# EAGLE design iceWerx Carrier before Lab 4 (EAGLE 9.6.2)
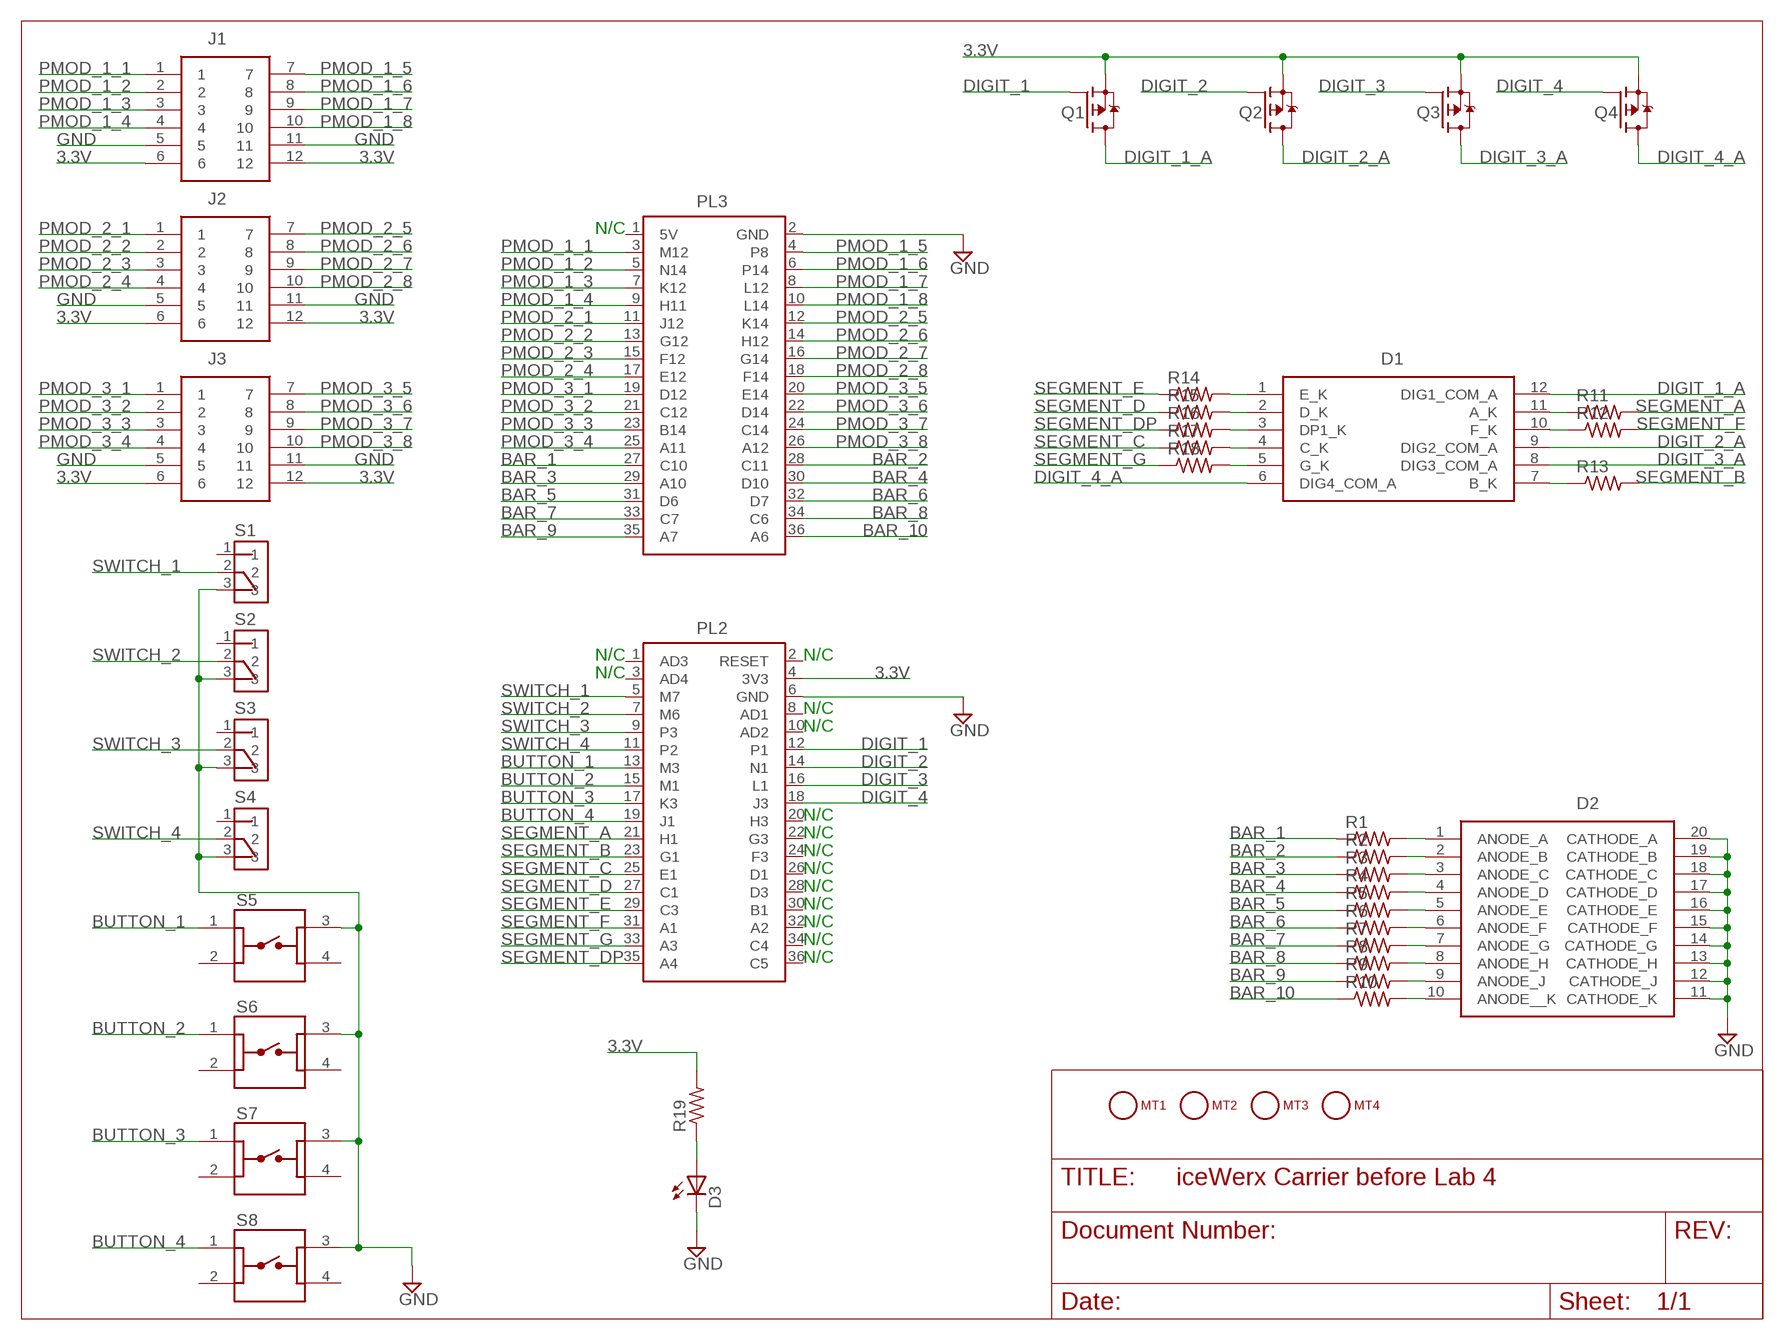
[diagram p0: schematic, sheet 1]

## Parts
D1  LDQ-M282RI  [LDQM282RI]
D2  LTA-1000G  [DIPS762W50P254L2527H825Q20N]
D3  LED5MM  [LED5MM]
J1  PMOD-SOCKET-FOR-HOST-BOARD  [PMOD-SOCKET-FOR-HOST-BOARD]
J2  PMOD-SOCKET-FOR-HOST-BOARD  [PMOD-SOCKET-FOR-HOST-BOARD]
J3  PMOD-SOCKET-FOR-HOST-BOARD  [PMOD-SOCKET-FOR-HOST-BOARD]
MT1  MOUNTING_HOLE-125_250_ROUND  [MT_125_250]
MT2  MOUNTING_HOLE-125_250_ROUND  [MT_125_250]
MT3  MOUNTING_HOLE-125_250_ROUND  [MT_125_250]
MT4  MOUNTING_HOLE-125_250_ROUND  [MT_125_250]
PL2  ICEWERX-PL2  [TE_4-1734506-1]
PL3  ICEWERX-PL3  [TE_4-1734506-1]
Q1  NX2301P  [SOT95P230X110-3N]
Q2  NX2301P  [SOT95P230X110-3N]
Q3  NX2301P  [SOT95P230X110-3N]
Q4  NX2301P  [SOT95P230X110-3N]
R1  R-US_0204/5  [0204/5]
R2  R-US_0204/5  [0204/5]
R3  R-US_0204/5  [0204/5]
R4  R-US_0204/5  [0204/5]
R5  R-US_0204/5  [0204/5]
R6  R-US_0204/5  [0204/5]
R7  R-US_0204/5  [0204/5]
R8  R-US_0204/5  [0204/5]
R9  R-US_0204/5  [0204/5]
R10  R-US_0204/5  [0204/5]
R11  R-US_0204/5  [0204/5]
R12  R-US_0204/5  [0204/5]
R13  R-US_0204/5  [0204/5]
R14  R-US_0204/5  [0204/5]
R15  R-US_0204/5  [0204/5]
R16  R-US_0204/5  [0204/5]
R17  R-US_0204/5  [0204/5]
R18  R-US_0204/5  [0204/5]
R19  R-US_0204/5  [0204/5]
S1  OS102011MS2QN1  [SW_OS102011MS2QN1]
S2  OS102011MS2QN1  [SW_OS102011MS2QN1]
S3  OS102011MS2QN1  [SW_OS102011MS2QN1]
S4  OS102011MS2QN1  [SW_OS102011MS2QN1]
S5  1825910-7  [SW_1825910-7]
S6  1825910-7  [SW_1825910-7]
S7  1825910-7  [SW_1825910-7]
S8  1825910-7  [SW_1825910-7]

## Nets
3.3V: J1.6 J1.12 J2.6 J2.12 J3.6 J3.12 PL2.4(3V3) Q1.2(S) Q2.2(S) Q3.2(S) Q4.2(S) R19.2
BAR_1: PL3.27(C10) R1.1
BAR_2: PL3.28(C11) R2.1
BAR_3: PL3.29(A10) R3.1
BAR_4: PL3.30(D10) R4.1
BAR_5: PL3.31(D6) R5.1
BAR_6: PL3.32(D7) R6.1
BAR_7: PL3.33(C7) R7.1
BAR_8: PL3.34(C6) R8.1
BAR_9: PL3.35(A7) R9.1
BAR_10: PL3.36(A6) R10.1
BUTTON_1: PL2.13(M3) S5.1
BUTTON_2: PL2.15(M1) S6.1
BUTTON_3: PL2.17(K3) S7.1
BUTTON_4: PL2.19(J1) S8.1
DIGIT_1: PL2.12(P1) Q1.1(G)
DIGIT_1_A: D1.12(DIG1_COM_A) Q1.3(D)
DIGIT_2: PL2.14(N1) Q2.1(G)
DIGIT_2_A: D1.9(DIG2_COM_A) Q2.3(D)
DIGIT_3: PL2.16(L1) Q3.1(G)
DIGIT_3_A: D1.8(DIG3_COM_A) Q3.3(D)
DIGIT_4: PL2.18(J3) Q4.1(G)
DIGIT_4_A: D1.6(DIG4_COM_A) Q4.3(D)
GND: D2.11(CATHODE_K) D2.12(CATHODE_J) D2.13(CATHODE_H) D2.14(CATHODE_G) D2.15(CATHODE_F) D2.16(CATHODE_E) D2.17(CATHODE_D) D2.18(CATHODE_C) D2.19(CATHODE_B) D2.20(CATHODE_A) D3.K(C) J1.5 J1.11 J2.5 J2.11 J3.5 J3.11 PL2.6(GND) PL3.2(GND) S1.3 S2.3 S3.3 S4.3 S5.3 S6.3 S7.3 S8.3
N$1: D2.1(ANODE_A) R1.2
N$2: D2.2(ANODE_B) R2.2
N$3: D2.3(ANODE_C) R3.2
N$4: D2.4(ANODE_D) R4.2
N$5: D2.5(ANODE_E) R5.2
N$6: D2.6(ANODE_F) R6.2
N$7: D2.7(ANODE_G) R7.2
N$8: D2.8(ANODE_H) R8.2
N$9: D2.9(ANODE_J) R9.2
N$10: D2.10(ANODE__K) R10.2
N$11: D1.11(A_K) R11.1
N$12: D1.10(F_K) R12.1
N$13: D1.7(B_K) R13.1
N$14: D1.1(E_K) R14.2
N$15: D1.2(D_K) R15.2
N$16: D1.3(DP1_K) R16.2
N$17: D1.4(C_K) R17.2
N$18: D1.5(G_K) R18.2
N$36: D3.A R19.1
PMOD_1_1: J1.1 PL3.3(M12)
PMOD_1_2: J1.2 PL3.5(N14)
PMOD_1_3: J1.3 PL3.7(K12)
PMOD_1_4: J1.4 PL3.9(H11)
PMOD_1_5: J1.7 PL3.4(P8)
PMOD_1_6: J1.8 PL3.6(P14)
PMOD_1_7: J1.9 PL3.8(L12)
PMOD_1_8: J1.10 PL3.10(L14)
PMOD_2_1: J2.1 PL3.11(J12)
PMOD_2_2: J2.2 PL3.13(G12)
PMOD_2_3: J2.3 PL3.15(F12)
PMOD_2_4: J2.4 PL3.17(E12)
PMOD_2_5: J2.7 PL3.12(K14)
PMOD_2_6: J2.8 PL3.14(H12)
PMOD_2_7: J2.9 PL3.16(G14)
PMOD_2_8: J2.10 PL3.18(F14)
PMOD_3_1: J3.1 PL3.19(D12)
PMOD_3_2: J3.2 PL3.21(C12)
PMOD_3_3: J3.3 PL3.23(B14)
PMOD_3_4: J3.4 PL3.25(A11)
PMOD_3_5: J3.7 PL3.20(E14)
PMOD_3_6: J3.8 PL3.22(D14)
PMOD_3_7: J3.9 PL3.24(C14)
PMOD_3_8: J3.10 PL3.26(A12)
SEGMENT_A: PL2.21(H1) R11.2
SEGMENT_B: PL2.23(G1) R13.2
SEGMENT_C: PL2.25(E1) R17.1
SEGMENT_D: PL2.27(C1) R15.1
SEGMENT_DP: PL2.35(A4) R16.1
SEGMENT_E: PL2.29(C3) R14.1
SEGMENT_F: PL2.31(A1) R12.2
SEGMENT_G: PL2.33(A3) R18.1
SWITCH_1: PL2.5(M7) S1.2
SWITCH_2: PL2.7(M6) S2.2
SWITCH_3: PL2.9(P3) S3.2
SWITCH_4: PL2.11(P2) S4.2
Unconnected: MT1.1 MT2.1 MT3.1 MT4.1 PL2.1(AD3) PL2.2(RESET) PL2.3(AD4) PL2.8(AD1) PL2.10(AD2) PL2.20(H3) PL2.22(G3) PL2.24(F3) PL2.26(D1) PL2.28(D3) PL2.30(B1) PL2.32(A2) PL2.34(C4) PL2.36(C5) PL3.1(5V) S1.1 S2.1 S3.1 S4.1 S5.2 S5.4 S6.2 S6.4 S7.2 S7.4 S8.2 S8.4

## Notes on the sheet
- N/C
- N/C | N/C
- N/C
- N/C
- N/C
- N/C
- N/C
- N/C
- N/C
- N/C
- N/C
- N/C
- N/C
- N/C

## Library data of the parts
D1 = eagle-library-engr-240-f22:LDQ-M282RI: LED Displays & Accessories LED Display Source: Datasheet <https://componentsearchengine.com/Datasheets/1/LDQ-M282RI.pdf>; DESCRIPTION: LED Displays & Accessories LED Display; HEIGHT: 6.05mm; MANUFACTURER_NAME: Lumex; MANUFACTURER_PART_NUMBER: LDQ-M282RI; MOUSER_PART_NUMBER: 696-LDQ-M282RI; MOUSER_PRICE-STOCK: https://www.mouser.com/Search/Refine.aspx?Keyword=696-LDQ-M282RI
D2 = eagle-library-engr-240-f22:LTA-1000G: LED Uni-Color Green 565nm 20-Pin PDIP Source: Datasheet <https://optoelectronics.liteon.com/upload/download/DS-30-92-0809/A1000G.pdf>; DESCRIPTION: LED Uni-Color Green 565nm 20-Pin PDIP; HEIGHT: 8.25mm; MANUFACTURER_NAME: Lite-On; MANUFACTURER_PART_NUMBER: LTA-1000G; MOUSER_PART_NUMBER: 859-LTA-1000G; MOUSER_PRICE-STOCK: https://www.mouser.co.uk/ProductDetail/Lite-On/LTA-1000G?qs=%2FTKcI5XXRKq0QINzVmwJHg%3D%3D
D3 = eagle-library-engr-240-f22:LED: LED OSRAM: - CHIPLED LG R971, LG N971, LY N971, LG Q971, LY Q971, LO R971, LY R971 LH N974, LH R974 LS Q976, LO Q976, LY Q976 LO Q996 - Hyper CHIPLED LW Q18S LB Q993, LB Q99A, LB R99A - SideLED LS A670, LO A670, LY A670, LG A670, LP A670 LB A673, LV A673, LT A673, LW A673 LH A674 LY A675 LS A676, LA A676, LO A676, LY A676, LW A676 LS A679, LY A679, LG A679 - Hyper Micro SIDELED® LS Y876, LA Y876, LO Y876, LY Y876 LT Y87S - SmartLED LW L88C, LW L88S LB L89C, LB L89S, LG L890 LS L89K, LO L89K, LY L89K LS L896, LA L896, LO L896, LY L896 - TOPLED LS T670, LO T670, LY T670, LG T670, LP T670 LSG T670, LSP T670, LSY T670, LOP T670, LYG T670 LG T671, LOG T671, LSG T671 LB T673, LV T673, LT T673, LW T673 LH T674 LS T676, LA T676, LO T676, LY T676, LB T676, LH T676, LSB T676, LW T676 LB T67C, LV T67C, LT T67C, LS T67K, LO T67K, LY T67K, LW E67C LS E67B, LA E67B, LO E67B, LY E67B, LB E67C, LV E67C, LT E67C LW T67C LS T679, LY T679, LG T679 LS T770, LO T770, LY T770, LG T770, LP T770 LB T773, LV T773, LT T773, LW T773 LH T774 LS E675, LA E675, LY E675, LS T675 LS T776, LA T776, LO T776, LY T776, LB T776 LHGB T686 LT T68C, LB T68C - Hyper Mini TOPLED® LB M676 - Mini TOPLED Santana® LG M470 LS M47K, LO M47K, LY M47K Source: http://www.osram.convergy.de/
J1-J3 = eagle-library-engr-240-f22:PMOD-SOCKET-FOR-HOST-BOARD
MT1-MT4 = eagle-library-engr-240-f22:MOUNTING_HOLE
PL2 = eagle-library-engr-240-f22:ICEWERX-PL2
PL3 = eagle-library-engr-240-f22:ICEWERX-PL3
Q1-Q4 = eagle-library-engr-240-f22:NX2301P; MANUFACTURER: Nexperia; MAXIMUM_PACKAGE_HEIGHT: 1.10 mm; PARTREV: 1; SNAPEDA_PN: NX2301P; STANDARD: IPC 7351B
R1-R19 = eagle-library-engr-240-f22:R-US_: RESISTOR, American symbol
S1-S4 = eagle-library-engr-240-f22:OS102011MS2QN1: Switch Slide ON ON SPDT Top Slide 0.1A 12VDC 10000Cycles PC Pins Thru-Hole Bulk; MANUFACTURER: C&K; STANDARD: MANUFACTURER RECOMMENDATIONS
S5-S8 = eagle-library-engr-240-f22:1825910-7: Switch Tactile OFF (ON) SPST Round Button PC Pins 0.05A 24VDC 100000Cycles 2.55N Thru-Hole Loose; MANUFACTURER: TE Connectivity; PARTREV: C10; STANDARD: Manufacturer Recommendation

## Board
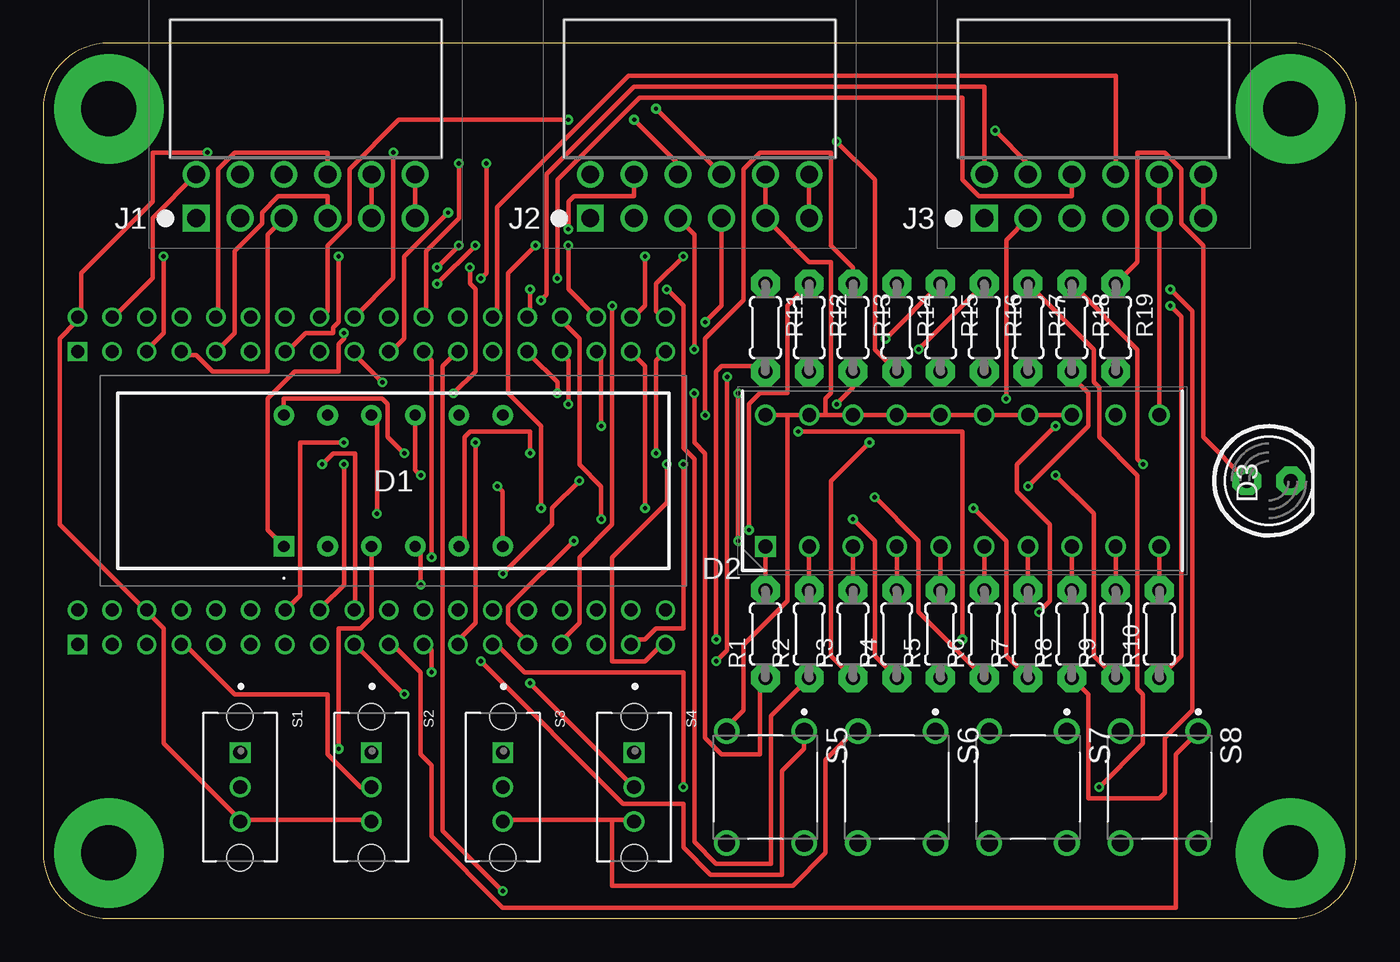
[diagram p1: board, top side]
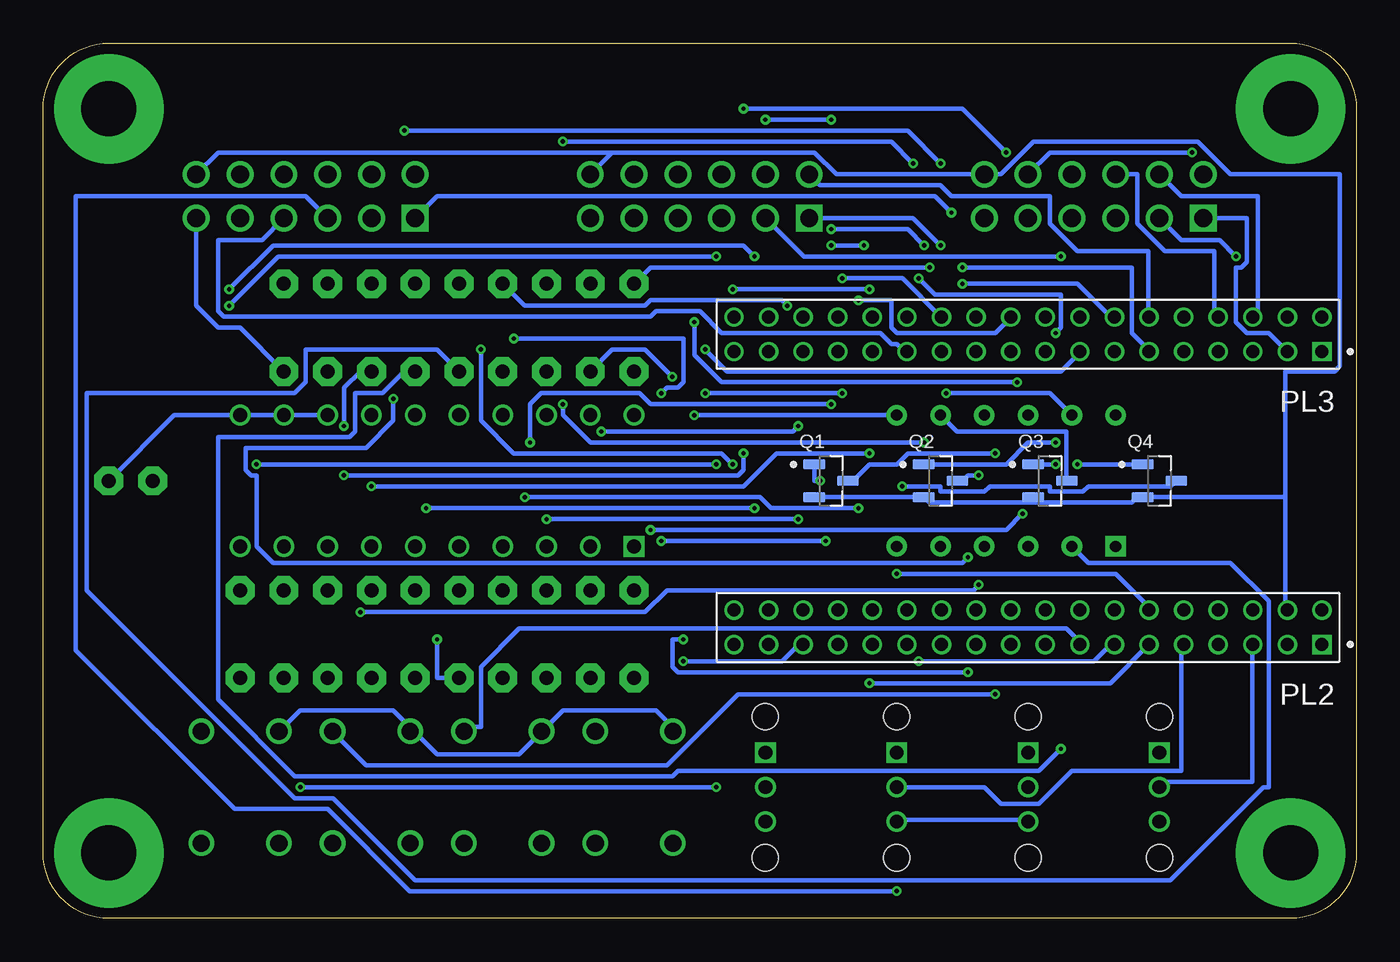
[diagram p2: board, bottom side, seen from below]

Size 76.2 x 50.8 mm. Coordinates in mm from the lower left corner, seen from the top.
Outline: 0,3.81 arc90 3.81,0 72.39,0 arc90 76.2,3.81 76.2,46.99 arc90 72.39,50.8 3.81,50.8 arc90 0,46.99 0,3.81
Copper layers (1*16): Top 0.035559375mm / dielectric 1.6mm / Bottom 0.035559375mm
Design rules "oshpark-2layer-auto-routing": minimum track width 10mil, minimum drill 10mil, track to track 10mil, track to pad 8mil, pad to pad 8mil, via to via 8mil, smd to smd 6mil, copper to edge 15mil, drill to drill 6mil, minimum pad ring 6mil, minimum via ring 6mil, stop-mask expansion 2.5mil, vias tented up to drill 0mil, thermal gap 10mil

### Footprints (pad centres in the part's own frame; a part is rotated, then mirrored left to right if it is on the bottom)
LDQM282RI = drill 0.65 pad 1.192 square: 1 0,0 | drill 0.65 pad 1.192: 2 2.54,0; 3 5.08,0; 4 7.62,0; 5 10.16,0; 6 12.7,0; 7 12.7,7.62; 8 10.16,7.62; 9 7.62,7.62; 10 5.08,7.62; 11 2.54,7.62; 12 0,7.62
DIPS762W50P254L2527H825Q20N = drill 0.8 pad 1.2 square: 1 0,0 | drill 0.8 pad 1.2: 2 0,-2.54; 3 0,-5.08; 4 0,-7.62; 5 0,-10.16; 6 0,-12.7; 7 0,-15.24; 8 0,-17.78; 9 0,-20.32; 10 0,-22.86; 11 7.62,-22.86; 12 7.62,-20.32; 13 7.62,-17.78; 14 7.62,-15.24; 15 7.62,-12.7; 16 7.62,-10.16; 17 7.62,-7.62; 18 7.62,-5.08; 19 7.62,-2.54; 20 7.62,0
LED5MM = drill 0.813 pad 1.676 octagon: A -1.27,0; K 1.27,0
PMOD-SOCKET-FOR-HOST-BOARD = drill 1.04 pad 1.55 square: 1 0,0 | drill 1.04 pad 1.55: 2 2.54,0; 3 5.08,0; 4 7.62,0; 5 10.16,0; 6 12.7,0; 7 0,2.54; 8 2.54,2.54; 9 5.08,2.54; 10 7.62,2.54; 11 10.16,2.54; 12 12.7,2.54
MT_125_250 = drill 3.175 pad 6.35: 1 0,0
TE_4-1734506-1 = drill 0.75 pad 1.1 square: 1 0,0 | drill 0.75 pad 1.1: 2 0,-2; 3 2.007,0; 4 2.007,-2; 5 4.013,0; 6 4.013,-2; 7 6.02,0; 8 6.02,-2; 9 8.026,0; 10 8.026,-2; 11 10.033,0; 12 10.033,-2; 13 12.04,0; 14 12.04,-2; 15 14.046,0; 16 14.046,-2; 17 16.053,0; 18 16.053,-2; 19 18.059,0; 20 18.059,-2; 21 20.066,0; 22 20.066,-2; 23 22.073,0; 24 22.073,-2; 25 24.079,0; 26 24.079,-2; 27 26.086,0; 28 26.086,-2; 29 28.092,0; 30 28.092,-2; 31 30.099,0; 32 30.099,-2; 33 32.106,0; 34 32.106,-2; 35 34.112,0; 36 34.112,-2
SOT95P230X110-3N = smd 1.26 x 0.59: 1 -0.98,0.95; 2 -0.98,-0.95; 3 0.98,0
0204/5 = drill 0.813 pad 1.676 octagon: 1 -2.54,0; 2 2.54,0
SW_OS102011MS2QN1 = drill 0.8 square: 1 -2,0 | drill 0.8: 2 0,0; 3 2,0 | hole 1.5: -4.1,0; 4.1,0
SW_1825910-7 = drill 0.99: 1 -3.25,2.25; 2 3.25,2.25; 3 -3.25,-2.25; 4 3.25,-2.25

### Placement (x,y rotation side)
D1  13.97,21.59 0 top
D2  41.91,21.59 90 top
D3  71.12,25.4 0 top
J1  8.89,40.64 0 top
J2  31.75,40.64 0 top
J3  54.61,40.64 0 top
MT1  3.81,3.81 0 top
MT2  72.39,3.81 0 top
MT3  72.39,46.99 0 top
MT4  3.81,46.99 0 top
PL2  2,15.9 180 bottom
PL3  2,32.9 180 bottom
Q1  30.48,25.4 0 bottom
Q2  24.13,25.4 0 bottom
Q3  17.78,25.4 0 bottom
Q4  11.43,25.4 0 bottom
R1  41.91,16.51 90 top
R2  44.45,16.51 90 top
R3  46.99,16.51 90 top
R4  49.53,16.51 90 top
R5  52.07,16.51 90 top
R6  54.61,16.51 90 top
R7  57.15,16.51 90 top
R8  59.69,16.51 90 top
R9  62.23,16.51 90 top
R10  64.77,16.51 90 top
R11  41.91,34.29 270 top
R12  44.45,34.29 270 top
R13  46.99,34.29 270 top
R14  49.53,34.29 270 top
R15  52.07,34.29 270 top
R16  54.61,34.29 270 top
R17  57.15,34.29 270 top
R18  59.69,34.29 270 top
R19  62.23,34.29 270 top
S1  11.43,7.62 270 top
S2  19.05,7.62 270 top
S3  26.67,7.62 270 top
S4  34.29,7.62 270 top
S5  41.91,7.62 270 top
S6  49.53,7.62 270 top
S7  57.15,7.62 270 top
S8  64.77,7.62 270 top

### Tracks (layer width: path | path; a pad name or v marks a point on that pad's centre or on a via)
3.3V
  Top 0.254: J3.12 J3.6 | J1.12 J1.6 | J2.12 J2.6
  Bottom 0.254: Q1.2 31.43,24.45 25.4,24.45 Q2.2 25.08,24.45 24.77,24.13 18.41,24.13 | 18.41,24.13 13.02,24.13 12.7,24.45 Q4.2 12.38,24.45 4.13,24.45 | 18.41,24.13 18.73,24.45 Q3.2 | 4.13,24.45 4.13,18.1 PL2.4 | R19.2 64.77,34.29 66.04,34.29 67.31,35.56 J3.6 | 43.18,44.45 31.43,44.45 30.16,43.18 J1.12 20.64,43.18 18.73,45.09 9.21,45.09 7.3,43.18 0.95,43.18 0.95,32.07 1.27,31.75 4.13,31.75 4.13,24.45 | J2.12 43.18,44.45 | J3.12 66.04,44.45 43.18,44.45
BAR_1  (via drill 0.25)
  Top 0.254: v29.84,30.48 29.84,31.11 28.26,32.7 PL3.27 | v37.78,30.48 37.78,27.62 38.42,26.99 38.42,10.48 39.37,9.53 41.59,9.53 41.59,13.65 R1.1
  Bottom 0.254: v37.78,30.48 v29.84,30.48
BAR_2  (via drill 0.25)
  Top 0.254: v28.26,36.51 28.26,34.92 PL3.28 | v36.2,36.51 37.15,35.56 37.15,27.3 37.78,26.67 37.78,4.45 39.05,3.17 42.23,3.17 42.23,11.75 R2.1
  Bottom 0.254: v36.2,36.51 v28.26,36.51
BAR_3  (via drill 0.25)
  Top 0.254: v30.48,29.84 30.48,32.38 30.16,32.7 PL3.29 | v47.94,27.62 45.72,25.4 45.72,15.24 R3.1
  Bottom 0.254: v30.48,29.84 40.96,29.84 41.59,30.48 47.31,30.48 47.94,29.84 v47.94,27.62
BAR_4  (via drill 0.25)
  Top 0.254: v32.38,23.18 32.38,25.08 31.11,26.35 31.11,33.66 30.16,34.61 PL3.30 | v46.99,23.18 48.26,21.91 48.26,15.24 R4.1
  Bottom 0.254: v46.99,23.18 v32.38,23.18
BAR_5  (via drill 0.25)
  Top 0.254: v32.38,28.57 32.38,32.7 PL3.31 | v43.81,28.26 53.34,28.26 v53.34,16.19
  Bottom 0.254: v32.38,28.57 32.7,28.26 v43.81,28.26 | v53.34,16.19 53.34,13.97 R5.1
BAR_6  (via drill 0.25)
  Top 0.254: v30.48,39.05 30.48,36.51 32.07,34.92 PL3.32 | v28.57,39.05 26.99,37.47 26.99,30.48 28.89,28.57 v28.89,23.81 | v48.26,24.45 50.8,21.91 50.8,17.78 R6.1
  Bottom 0.254: v28.57,39.05 v30.48,39.05 | v28.89,23.81 33.97,23.81 34.61,24.45 v48.26,24.45
BAR_7  (via drill 0.25)
  Top 0.254: v34.92,23.81 34.92,32.07 34.29,32.7 PL3.33 | v53.98,23.81 55.88,21.91 55.88,15.24 R7.1
  Bottom 0.254: v53.98,23.81 v34.92,23.81
BAR_8  (via drill 0.25)
  Top 0.254: v34.92,38.42 34.92,35.56 34.29,34.92 PL3.34 | v65.41,36.51 66.67,35.24 66.67,12.06 65.09,10.48 65.09,7.3 64.77,6.99 60.64,6.99 60.64,13.02 R8.1
  Bottom 0.254: v34.92,38.42 35.56,39.05 62.87,39.05 v65.41,36.51
BAR_9  (via drill 0.25)
  Top 0.254: v35.56,26.99 35.56,32.38 35.88,32.7 PL3.35 | v58.74,25.72 60.96,23.5 60.96,15.24 R9.1
  Bottom 0.254: v35.56,26.99 35.56,26.04 35.88,25.72 v58.74,25.72
BAR_10  (via drill 0.25)
  Top 0.254: v37.15,38.42 35.56,36.83 35.56,35.24 35.88,34.92 PL3.36 | v65.41,35.56 66.04,34.92 66.04,15.24 R10.1
  Bottom 0.254: v37.15,38.42 62.55,38.42 v65.41,35.56
BUTTON_1  (via drill 0.25)
  Top 0.254: v25.4,14.92 33.66,6.67 37.15,6.67 37.15,4.13 38.73,2.54 42.86,2.54 42.86,8.57 44.13,9.84 44.13,10.79 S5.1
  Bottom 0.254: v25.4,14.92 15.24,14.92 14.29,15.88 PL2.13
BUTTON_2
  Bottom 0.254: PL2.15 16.19,16.19 16.83,16.83 48.58,16.83 50.8,14.61 50.8,11.11 51.75,11.11 S6.1
BUTTON_3  (via drill 0.25)
  Top 0.254: v20.95,13.02 18.1,15.88 PL2.17
  Bottom 0.254: v20.95,13.02 35.88,13.02 40.01,8.89 57.47,8.89 59.37,10.79 S7.1
BUTTON_4
  Top 0.254: PL2.19 20.32,15.88 21.91,14.29 21.91,9.53 22.54,8.89 22.54,4.76 26.67,0.64 65.72,0.64 65.72,9.53 66.99,10.79 S8.1
DIGIT_1  (via drill 0.25)
  Top 0.254: v31.11,25.4 29.53,23.81 29.53,22.86 v26.67,20
  Bottom 0.254: v31.11,25.4 31.43,25.4 31.43,26.35 Q1.1 | v26.67,20 13.97,20 12.06,18.1 PL2.12
DIGIT_1_A  (via drill 0.25)
  Top 0.254: v20.95,26.99 20,27.94 20,29.84 19.68,30.16 13.97,30.16 D1.12
  Bottom 0.254: v20.95,26.99 26.04,26.99 26.67,26.35 28.26,26.35 29.21,25.4 Q1.3
DIGIT_2  (via drill 0.25)
  Top 0.254: v17.46,27.62 14.92,27.62 14.92,18.73 14.29,18.1 PL2.14
  Bottom 0.254: v17.46,27.62 19.05,27.62 20.32,26.35 25.08,26.35 Q2.1
DIGIT_2_A  (via drill 0.25)
  Top 0.254: v21.91,25.72 21.59,26.04 D1.9
  Bottom 0.254: v21.91,25.72 22.54,25.72 22.86,25.4 Q2.3
DIGIT_3  (via drill 0.25)
  Top 0.254: v17.46,26.35 17.46,19.37 16.19,18.1 PL2.16
  Bottom 0.254: v17.46,26.35 18.73,26.35 Q3.1
DIGIT_3_A
  Bottom 0.254: D1.8 23.18,28.26 16.83,28.26 16.83,25.4 Q3.3
DIGIT_4  (via drill 0.25)
  Top 0.254: v16.19,26.35 16.83,26.99 18.1,26.99 18.1,18.1 PL2.18
  Bottom 0.254: v16.19,26.35 12.7,26.35 Q4.1
DIGIT_4_A  (via drill 0.25)
  Top 0.254: v26.35,25.08 26.67,24.77 D1.6
  Bottom 0.254: v26.35,25.08 24.13,25.08 24.13,24.77 21.59,24.77 21.27,25.08 17.78,25.08 17.78,24.77 15.88,24.77 15.56,25.08 10.79,25.08 10.48,25.4 Q4.3
GND  (via drill 0.25)
  Top 0.254: J3.11 J3.5 D2.11 | J2.11 J2.5 44.45,38.1 45.72,38.1 45.72,30.48 45.4,30.16 45.4,29.21 | 43.18,29.21 D2.19 45.4,29.21 | 43.18,29.21 D2.20 | 45.4,29.21 D2.18 D2.17 D2.16 D2.15 D2.14 D2.13 | 43.18,29.21 43.18,18.41 40.64,15.88 40.64,12.06 39.69,11.11 S5.3 | 33.02,5.71 34.29,5.71 S4.3 | 33.02,5.71 26.67,5.71 S3.3 | J1.11 J1.5 | 11.43,5.71 6.99,10.16 6.99,16.83 6.03,17.78 PL2.6 5.71,18.1 0.95,22.86 0.95,33.66 1.91,34.61 PL3.2 2.22,34.92 2.22,37.47 6.35,41.59 6.35,44.45 v9.53,44.45 | 11.43,5.71 19.05,5.71 S2.3 | 11.43,5.71 S1.3 | 33.02,5.71 33.02,1.91 43.5,1.91 45.4,3.81 45.4,9.21 46.99,10.79 S6.3
  Bottom 0.254: S5.3 39.69,11.11 40.64,12.06 46.04,12.06 46.99,11.11 S6.3 47.31,10.79 48.58,9.53 53.34,9.53 54.61,10.79 S7.3 54.93,11.11 55.88,12.06 61.28,12.06 62.23,11.11 S8.3 | D2.13 D2.12 D2.11 68.58,29.21 D3.K | J1.11 17.78,44.45 v9.53,44.45 | S3.3 26.67,5.71 19.05,5.71 S2.3
N$1
  Top 0.254: R1.2 D2.1
N$2
  Top 0.254: R2.2 D2.2
N$3
  Top 0.254: R3.2 D2.3
N$4
  Top 0.254: R4.2 D2.4
N$5
  Top 0.254: R5.2 D2.5
N$6
  Top 0.254: R6.2 D2.6
N$7
  Top 0.254: R7.2 D2.7
N$8
  Top 0.254: R8.2 D2.8
N$9
  Top 0.254: R9.2 D2.9
N$10
  Top 0.254: R10.2 D2.10
N$11  (via drill 0.25)
  Top 0.254: v23.81,30.48 25.08,31.75 25.08,36.51 24.77,36.83 v24.77,37.78
  Bottom 0.254: D1.11 17.78,30.48 v23.81,30.48 | v24.77,37.78 40.96,37.78 R11.1
N$12  (via drill 0.25)
  Top 0.254: D1.10 19.37,28.89 v19.37,23.5 | v40.96,22.54 40.96,29.84 41.59,30.48 43.18,30.48 43.18,35.56 R12.1
  Bottom 0.254: v19.37,23.5 20.32,22.54 v40.96,22.54
N$13  (via drill 0.25)
  Top 0.254: v38.42,29.21 38.42,33.66 40.64,35.88 40.64,43.5 41.59,44.45 45.72,44.45 45.72,39.05 46.99,37.78 R13.1
  Bottom 0.254: v38.42,29.21 D1.7
N$14  (via drill 0.25)
  Top 0.254: D1.1 13.02,22.54 13.02,30.16 14.61,31.75 17.14,31.75 17.14,33.34 17.46,33.66 v17.46,33.97 | v25.4,37.15 25.72,37.47 v25.72,43.81 | v46.04,45.09 48.26,42.86 48.26,33.02 R14.2
  Bottom 0.254: v17.46,33.97 17.14,34.29 17.14,36.2 24.45,36.2 v25.4,37.15 | v25.72,43.81 26.99,45.09 v46.04,45.09
N$15
  Bottom 0.254: D1.2 15.56,20.64 7.3,20.64 5.08,18.41 5.08,7.62 5.4,7.62 10.79,2.22 54.61,2.22 59.37,6.99 61.59,6.99 73.66,19.05 73.66,30.48 61.59,30.48 60.96,31.11 60.96,33.02 53.34,33.02 R15.2
N$16  (via drill 0.25)
  Top 0.254: D1.3 19.05,17.46 18.41,16.83 17.14,16.83 v17.14,9.84
  Bottom 0.254: v17.14,9.84 18.41,8.57 39.37,8.57 39.69,8.26 61.59,8.26 66.04,12.7 66.04,27.94 58.42,27.94 58.1,28.26 58.1,30.48 56.52,30.48 55.24,31.75 R16.2
N$17  (via drill 0.25)
  Top 0.254: D1.4 21.91,21.27 v21.91,19.37 | v57.78,17.78 58.42,18.41 58.42,22.86 56.52,24.77 56.52,26.35 v58.74,28.57
  Bottom 0.254: v21.91,19.37 22.23,19.05 40.01,19.05 41.27,17.78 v57.78,17.78 | v58.74,28.57 58.74,30.8 57.78,31.75 R17.2
N$18  (via drill 0.25)
  Top 0.254: D1.5 24.45,21.91 24.45,27.94 24.77,28.26 28.26,28.26 v28.26,26.99 | v57.15,25.08 60.64,28.57 60.64,30.48 59.69,31.43 R18.2
  Bottom 0.254: v28.26,26.99 33.66,26.99 35.56,25.08 v57.15,25.08
N$36
  Top 0.254: D3.A 67.31,27.94 67.31,39.05 66.04,40.32 66.04,43.5 65.09,44.45 63.5,44.45 63.5,38.1 R19.1
PMOD_1_1
  Bottom 0.254: J1.1 6.35,40.64 6.35,38.1 6.67,37.78 6.99,37.78 6.99,34.61 6.35,33.97 5.08,33.97 4.13,33.02 PL3.3
PMOD_1_2  (via drill 0.25)
  Top 0.254: v6.99,38.42 6.99,33.97 6.03,33.02 PL3.5
  Bottom 0.254: v6.99,38.42 7.94,39.37 10.16,39.37 J1.2
PMOD_1_3
  Top 0.254: J1.3 13.02,39.69 13.02,31.75 9.84,31.75 8.89,32.7 8.26,32.7 PL3.7
PMOD_1_4
  Top 0.254: J1.4 16.51,41.91 13.65,41.91 12.7,40.96 12.7,40.32 11.11,38.73 11.11,33.97 10.16,33.02 PL3.9
PMOD_1_5
  Top 0.254: J1.7 6.35,40.64 6.35,37.15 4.13,34.92 PL3.4
PMOD_1_6
  Bottom 0.254: J1.8 10.16,41.91 5.71,41.91 5.71,34.92 PL3.6
PMOD_1_7
  Bottom 0.254: J1.9 12.7,43.18 12.7,40.32 11.11,38.73 8.26,38.73 8.26,34.92 PL3.8
PMOD_1_8
  Top 0.254: J1.10 16.51,44.45 11.11,44.45 10.16,43.5 10.16,34.92 PL3.10
PMOD_2_1  (via drill 0.25)
  Top 0.254: v24.13,39.05 v22.86,37.78
  Bottom 0.254: v22.86,37.78 13.02,37.78 13.02,33.97 12.06,33.02 PL3.11 | v24.13,39.05 25.72,40.64 J2.1
PMOD_2_2  (via drill 0.25)
  Top 0.254: v17.14,38.42 17.14,34.61 16.83,34.29 16.83,33.97 15.24,33.97 14.29,33.02 PL3.13
  Bottom 0.254: v17.14,38.42 32.07,38.42 J2.2
PMOD_2_3  (via drill 0.25)
  Top 0.254: v37.78,33.02 37.78,39.69 J2.3
  Bottom 0.254: v37.78,33.02 36.51,31.75 17.14,31.75 16.19,32.7 PL3.15
PMOD_2_4  (via drill 0.25)
  Top 0.254: v19.68,31.11 18.1,32.7 PL3.17 | v38.42,34.61 39.37,35.56 J2.4
  Bottom 0.254: v19.68,31.11 36.83,31.11 38.42,32.7 v38.42,34.61
PMOD_2_5
  Bottom 0.254: J2.7 31.11,42.55 24.13,42.55 23.5,41.91 17.78,41.91 17.78,40.32 16.19,38.73 12.06,38.73 12.06,34.92 PL3.12
PMOD_2_6  (via drill 0.25)
  Top 0.254: v25.08,39.05 v22.86,36.83 | v30.48,40.01 30.48,41.59 30.8,41.91 34.29,41.91 J2.8
  Bottom 0.254: v22.86,36.83 16.19,36.83 14.29,34.92 PL3.14 | v25.08,39.05 26.04,40.01 v30.48,40.01
PMOD_2_7  (via drill 0.25)
  Top 0.254: v30.48,46.35 20.64,46.35 17.78,43.5 17.78,40.32 16.51,39.05 16.51,35.24 16.19,34.92 PL3.16 | v34.29,46.35 36.83,43.81 J2.9
  Bottom 0.254: v34.29,46.35 v30.48,46.35
PMOD_2_8  (via drill 0.25)
  Top 0.254: v20.32,44.45 20.32,37.15 18.1,34.92 PL3.18 | J2.10 v35.56,46.99
  Bottom 0.254: v20.32,44.45 22.86,46.99 v35.56,46.99
PMOD_3_1  (via drill 0.25)
  Top 0.254: v23.5,40.96 20.95,38.42 20.95,33.66 20.32,33.02 PL3.19
  Bottom 0.254: v23.5,40.96 24.45,41.91 53.34,41.91 J3.1
PMOD_3_2  (via drill 0.25)
  Top 0.254: v22.54,20.95 22.54,32.38 22.23,32.7 PL3.21 | v55.88,30.16 55.88,39.37 J3.2
  Bottom 0.254: v22.54,20.95 22.86,20.64 62.87,20.64 63.82,21.59 63.82,25.72 64.14,25.72 64.45,26.04 64.45,27.3 57.47,27.3 55.88,28.89 v55.88,30.16
PMOD_3_3  (via drill 0.25)
  Top 0.254: v26.67,1.59 23.18,5.08 23.18,32.07 23.81,32.7 PL3.23
  Bottom 0.254: v26.67,1.59 54.93,1.59 59.69,6.35 65.09,6.35 74.3,15.56 74.3,41.91 60.96,41.91 J3.3
PMOD_3_4
  Bottom 0.254: J3.4 63.5,39.37 66.04,39.37 66.04,35.24 65.72,34.92 40.96,34.92 40.64,35.24 38.1,35.24 36.83,33.97 27.62,33.97 26.99,33.34 26.67,33.34 26.35,33.02 PL3.25
PMOD_3_5  (via drill 0.25)
  Top 0.254: v28.89,35.88 29.21,36.2 29.21,43.18 34.29,48.26 54.61,48.26 J3.7
  Bottom 0.254: v28.89,35.88 26.99,35.88 26.99,34.29 26.67,33.97 20.95,33.97 20.32,34.61 PL3.20
PMOD_3_6  (via drill 0.25)
  Top 0.254: v24.13,43.81 24.13,40.64 22.23,38.73 22.23,34.92 PL3.22 | v55.24,45.72 57.15,43.81 J3.8
  Bottom 0.254: v24.13,43.81 26.04,45.72 v55.24,45.72
PMOD_3_7  (via drill 0.25)
  Top 0.254: v29.84,37.15 29.84,42.86 34.61,47.62 53.34,47.62 53.34,42.86 54.29,41.91 59.69,41.91 J3.9
  Bottom 0.254: v29.84,37.15 26.35,37.15 24.13,34.92 PL3.24
PMOD_3_8
  Top 0.254: J3.10 62.23,48.9 33.97,48.9 26.35,41.27 26.35,34.92 PL3.26
SEGMENT_A  (via drill 0.25)
  Top 0.254: v22.54,14.29 22.54,15.56 22.23,15.88 PL2.21 | v39.05,16.19 39.05,31.75 39.37,32.07 41.91,32.07 R11.2
  Bottom 0.254: v22.54,14.29 39.37,14.29 39.69,14.61 39.69,16.19 v39.05,16.19
SEGMENT_B  (via drill 0.25)
  Top 0.254: v25.08,27.62 25.08,17.14 24.13,16.19 PL2.23 | v46.04,29.84 46.99,30.8 R13.2
  Bottom 0.254: v25.08,27.62 44.45,27.62 46.04,29.21 v46.04,29.84
SEGMENT_C  (via drill 0.25)
  Top 0.254: v37.15,7.62 37.15,14.29 27.94,14.29 26.35,15.88 PL2.25 | v61.28,7.62 63.82,10.16 63.82,13.02 63.5,13.34 63.5,25.72 61.28,27.94 61.28,30.8 60.96,31.11 60.96,33.02 R17.1
  Bottom 0.254: v61.28,7.62 v37.15,7.62
SEGMENT_D  (via drill 0.25)
  Top 0.254: v30.8,21.91 26.99,18.1 26.99,17.14 27.94,16.19 PL2.27 | v40.32,30.48 v40.32,21.91 | R15.1 v48.9,33.66
  Bottom 0.254: v40.32,21.91 v30.8,21.91 | v40.32,30.48 40.01,30.8 39.37,30.8 39.05,31.11 39.05,33.66 v48.9,33.66
SEGMENT_DP  (via drill 0.25)
  Top 0.254: v36.2,26.35 36.2,24.13 33.02,20.95 33.02,14.92 34.92,14.92 35.88,15.88 PL2.35 | R16.1 v50.8,33.02
  Bottom 0.254: v36.2,26.35 36.83,26.99 48.9,26.99 50.8,28.89 v50.8,33.02
SEGMENT_E  (via drill 0.25)
  Top 0.254: v33.02,35.56 33.02,22.86 31.11,20.95 31.11,17.14 30.16,16.19 PL2.29
  Bottom 0.254: v33.02,35.56 33.34,35.88 40.96,35.88 41.27,35.56 48.26,35.56 R14.1
SEGMENT_F  (via drill 0.25)
  Top 0.254: v39.05,14.92 39.69,15.56 v39.69,31.43
  Bottom 0.254: v39.05,14.92 33.34,14.92 32.38,15.88 PL2.31 | v39.69,31.43 41.27,33.02 43.18,33.02 R12.2
SEGMENT_G  (via drill 0.25)
  Top 0.254: v37.15,26.35 37.15,16.83 35.56,16.83 34.92,16.19 34.29,16.19 PL2.33 | v63.82,26.35 63.5,26.67 63.5,33.02 R18.1
  Bottom 0.254: v63.82,26.35 v37.15,26.35
SWITCH_1
  Bottom 0.254: S1.2 11.11,7.94 6.03,7.94 6.03,15.88 PL2.5
SWITCH_2
  Top 0.254: S2.2 18.41,7.62 16.51,9.53 16.51,13.02 11.11,13.02 8.26,15.88 PL2.7
SWITCH_3
  Bottom 0.254: S3.2 21.59,7.62 20.64,6.67 18.41,6.67 16.51,8.57 10.16,8.57 10.16,15.88 PL2.9
SWITCH_4  (via drill 0.25)
  Top 0.254: S4.2 v28.26,13.65
  Bottom 0.254: v28.26,13.65 14.29,13.65 12.06,15.88 PL2.11